# EasyEDA Pro project tachyon.eprj, board Front
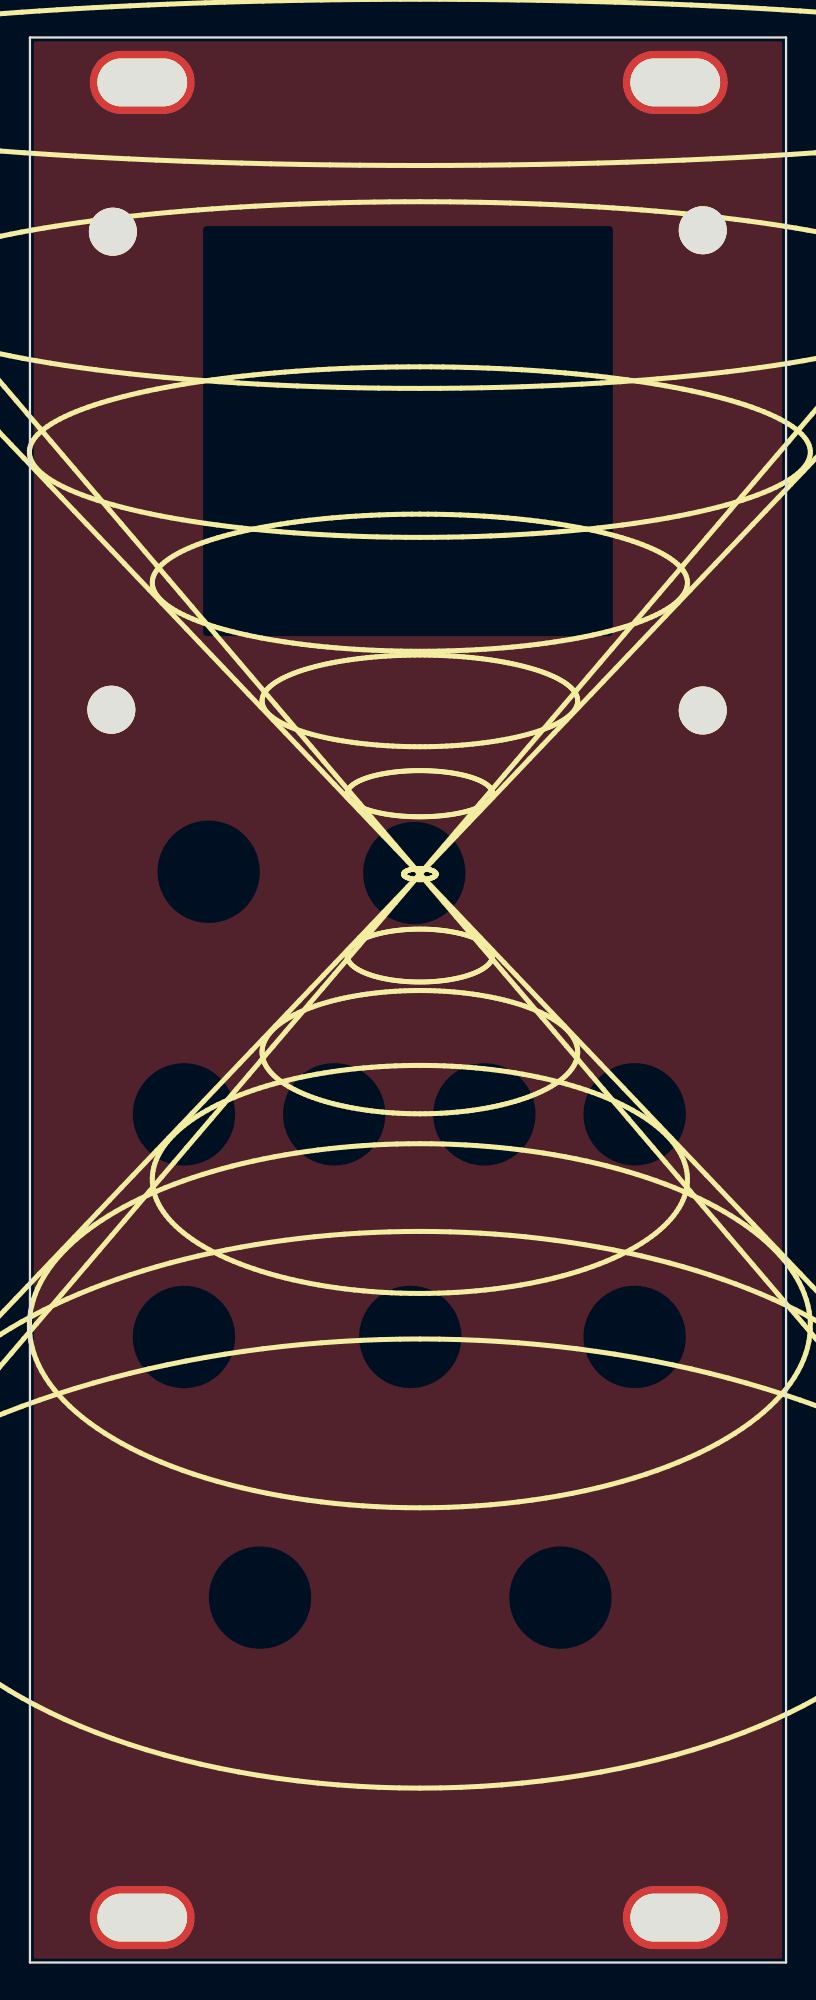
[diagram p8: board, top side]
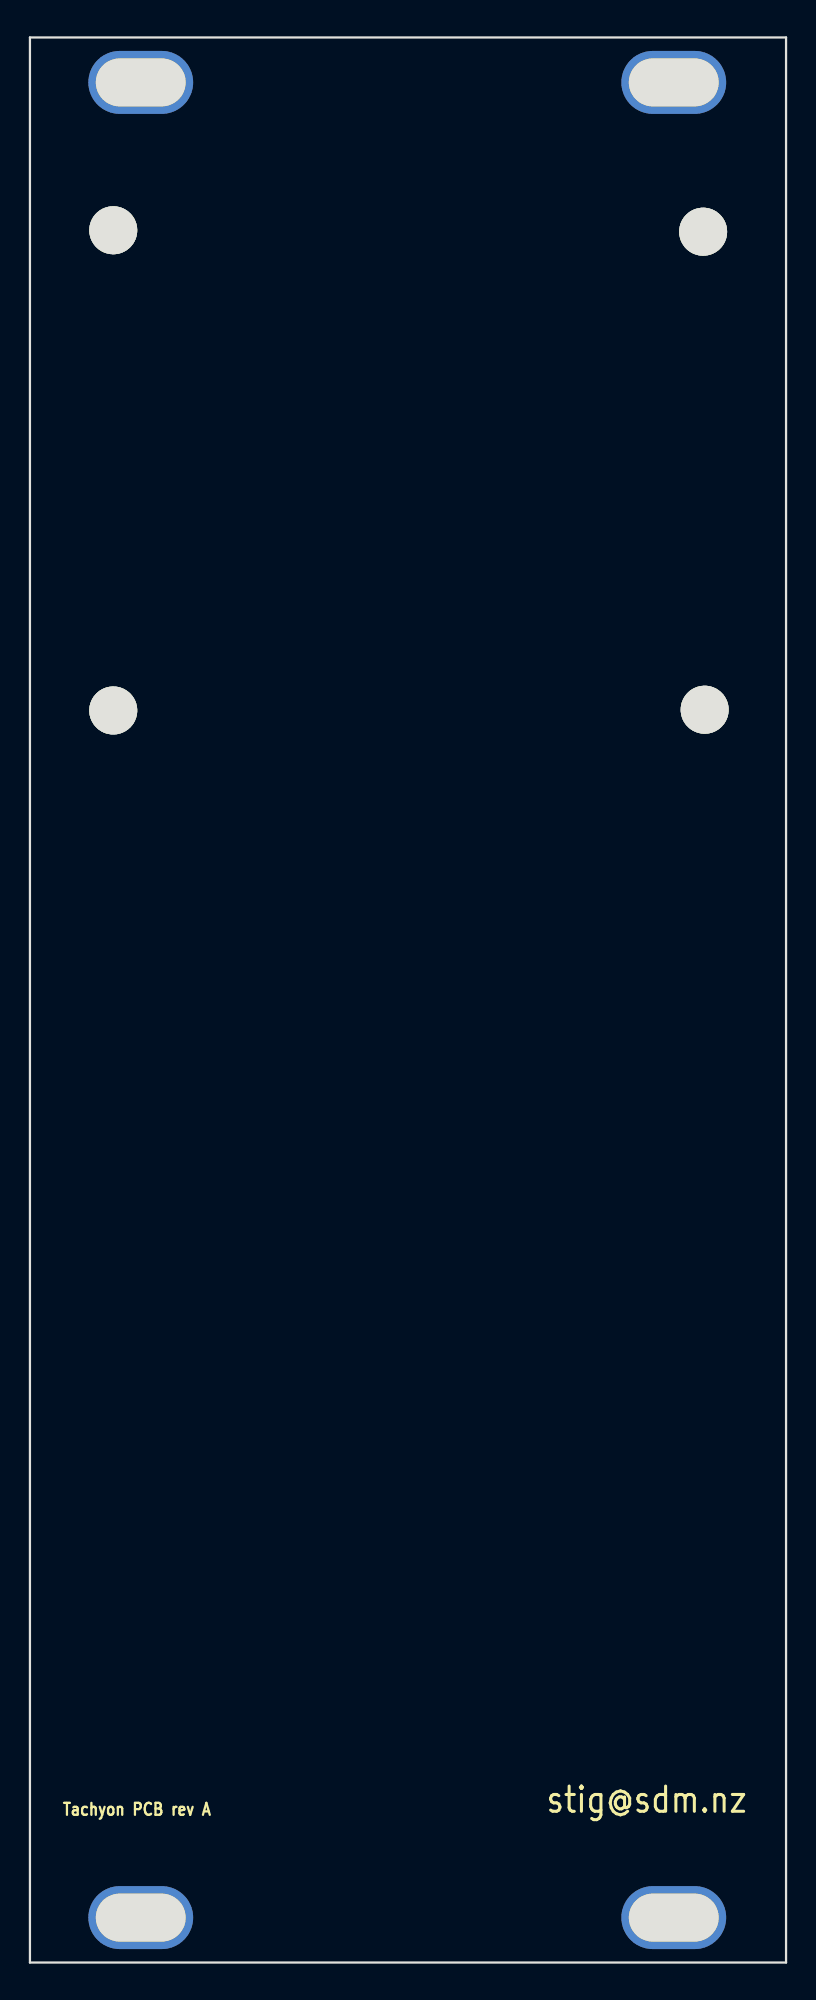
[diagram p9: board, bottom side, seen from below]

Outline 50.5 x 128.5 mm; copper layers: Top Layer, Bottom Layer. Coordinates in mm from the lower left corner of the outline.
Outline path: 0,128.5 0,0 50.5,0 50.5,128.5 0,128.5
Stack: Top Layer 0.035mm / Dielectric1 1.51mm FR4 er 4.5 / Bottom Layer 0.035mm

## Design rules (mm)
template: Custom Config
spacing copperThickness1oz (default): track to track 0.102, other pairs 0.152 to 0.3
spacing copperThickness2oz: track to track 0.203, other pairs 0.152 to 0.3
track width copperThickness1oz (default): min 0.127, default 0.254, max 2.54
track width copperThickness2oz: min 0.203, default 0.254, max 2.54
differential pair differentialPair (default): width min 0.127, default 0.254, max 2.54; gap min 0.152, default 0.152
via viaSize (default): diameter min 0.5, default 0.61, max 10; hole min 0.3, default 0.305, max 6.3
net GND uses copperRegion1

## Placement (name value [footprint] x y rotation side)
NOREF  -  [footprint_4743]  43.1 3 0 top
NOREF#2  -  [footprint_4743]  7.5 3 0 top
NOREF#3  -  [footprint_4743]  7.5 125.5 0 top
REF**  MountingHole_M3  [Eurorack:MountingHole_M3]  43.1 125.5 0 top
SCREW1  -  [Screw-Hole-M3]  45 115.57 0 top
SCREW2  -  [Screw-Hole-M3]  45 83.51 0 top
SCREW3  -  [Screw-Hole-M3]  5.5 83.56 0 top
SCREW4  -  [Screw-Hole-M3]  5.6 115.47 0 top

## Footprints (pads in the part's own frame, mm; a bottom-side part is the same pattern mirrored in y, then rotated)
Eurorack:MountingHole_M3
  oval 7x4.2 hole 6x3.2: (0,0)
footprint_4743
  oval 7x4.2 hole 6x3.2: (0,0)
Screw-Hole-M3
  round 3.2 hole 3.2: 1(-0.064,0.064)

## Nets
GND: NOREF. NOREF#2. NOREF#3. REF**. SCREW1.1 SCREW2.1 SCREW3.1 SCREW4.1

## Copper pours and planes (outline as drawn; the poured copper is in the pictures)
GND on Top Layer: 0,128.5 50.5,128.5 50.5,0 0,0

## Text on the board
Bottom Silkscreen Layer: Tachyon PCB rev A | stig@sdm.nz
Top Solder Mask Layer: TACHYON
